# Altium schematic sheet 6.LC DSP_TMS320F28069.SchDoc: 6.6kW Daul OBC +11kW WPT
size A3; Revision: V 1.0; SheetNumber: 6; SheetTotal: 14; ImagePath: 0
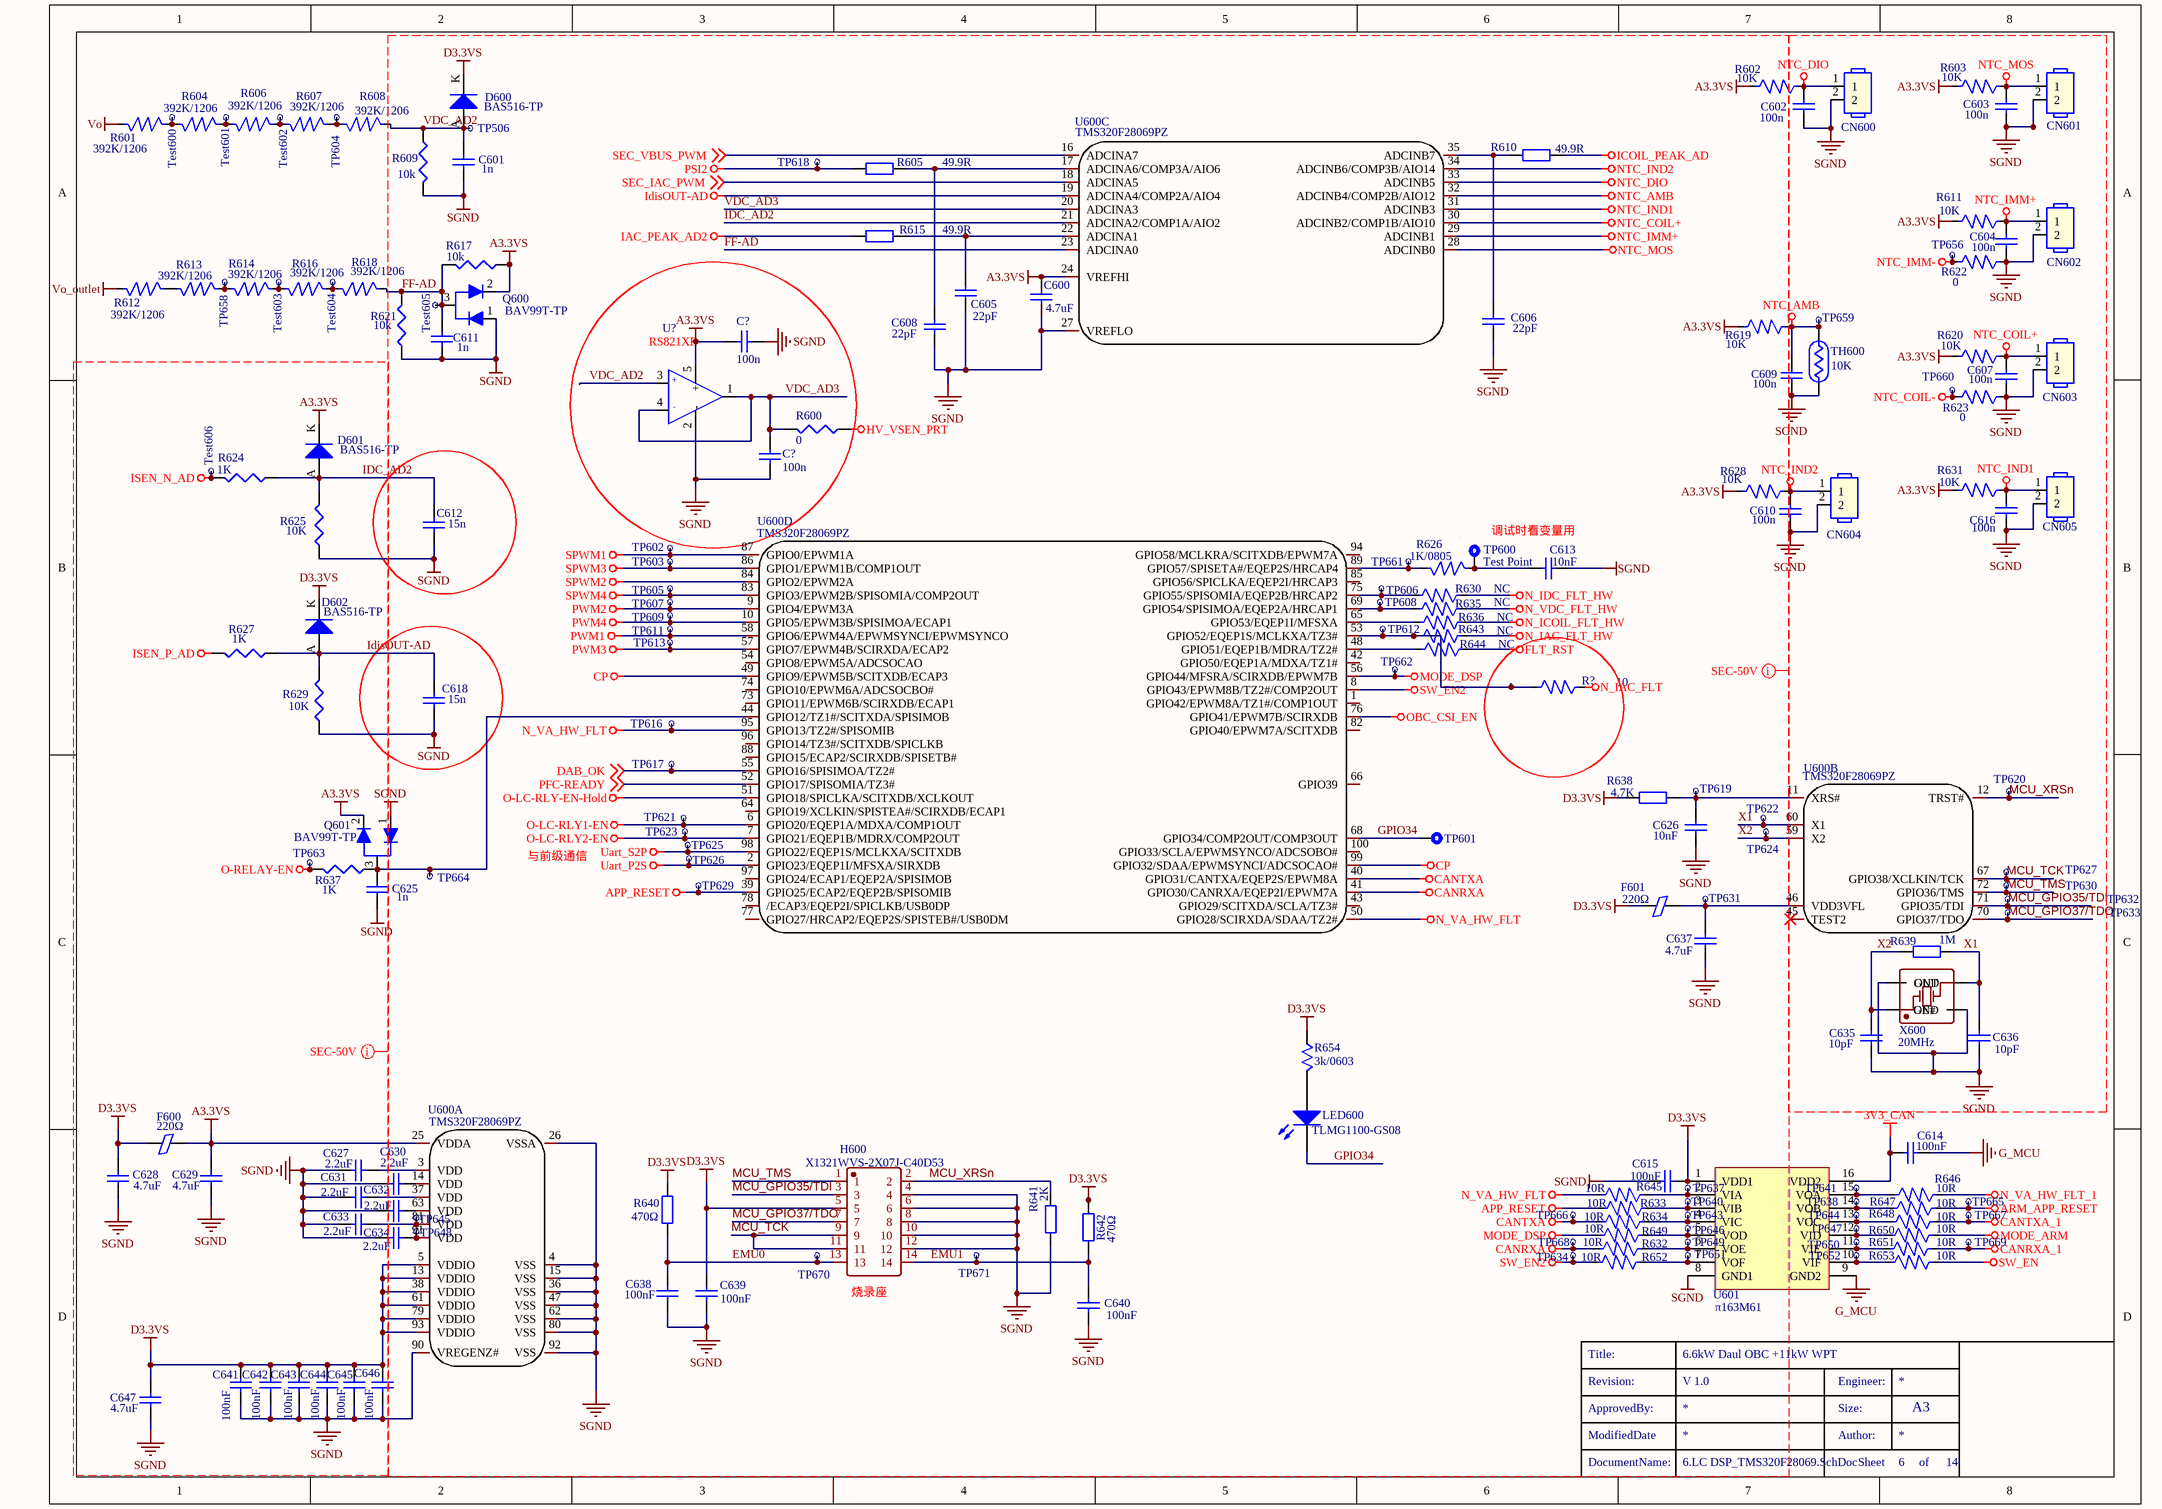
[diagram p0: 6.LC DSP_TMS320F28069.SchDoc]

## Parts
(Parts that share a designator on the sheet are numbered #1, #2 ... from top to bottom, then left to right.)
C600  4.7uF  [C0805]
C601  1n  [C0402]
C602  100n  [C0402]
C603  100n  [C0402]
C604  100n  [C0402]
C605  22pF  [C0402]
C606  22pF  [C0402]
C607  100n  [C0402]
C608  22pF  [C0402]
C609  100n  [C0402]
C610  100n  [C0402]
C611  1n  [C0402]
C612  value 15n  [C0402]  (hidden comment: 1n)
C613  10nF  [C0402]
C614  100nF  [C0402]
C615  100nF  [C0402]
C616  100n  [C0402]
C618  value 15n  [C0402]  (hidden comment: 1n)
C625  1n  [C0402]
C626  10nF  [C0603]
C627  2.2uF  [C0603]
C628  4.7uF  [C0805]
C629  4.7uF  [C0805]
C630  2.2uF  [C0603]
C631  2.2uF  [C0603]
C632  2.2uF  [C0603]
C633  2.2uF  [C0603]
C634  2.2uF  [C0603]
C635  10pF  [C0402]
C636  10pF  [C0402]
C637  4.7uF  [C0805]
C638  100nF  [C0603]
C639  100nF  [C0603]
C640  100nF  [C0603]
C641  100nF  [C0603]
C642  100nF  [C0603]
C643  100nF  [C0603]
C644  100nF  [C0603]
C645  100nF  [C0603]
C646  100nF  [C0603]
C647  4.7uF  [C0805]
C?#1  100n  [C0402]
C?#2  100n  [C0402]
CN600  (no value)  [HY_2MM_1*2P_90MOLEX01]
CN601  (no value)  [HY_2MM_1*2P_90MOLEX01]
CN602  (no value)  [HY_2MM_1*2P_90MOLEX01]
CN603  (no value)  [HY_2MM_1*2P_90MOLEX01]
CN604  (no value)  [HY_2MM_1*2P_90MOLEX01]
CN605  (no value)  [HY_2MM_1*2P_90MOLEX01]
D600  BAS516-TP  [D_SOD-523_SC-79]
D601  BAS516-TP  [D_SOD-523_SC-79]
D602  BAS516-TP  [D_SOD-523_SC-79]
F600  220Ω  [R0603]
F601  220Ω  [R0603]
H600  X1321WVS-2X07J-C40D53  [HDR-SMD_14P-P1.27-V-M-R2-C7-LS5.3]
LED600  TLMG1100-GS08  [LED_0603]
Q600  BAV99T-TP  [D_SOT-523]
Q601  BAV99T-TP  [D_SOT-523]
R600  0  [R0402]
R601  392K/1206  [R1206]
R602  10K  [R0402]
R603  10K  [R0402]
R604  392K/1206  [R1206]
R605  49.9R  [R0402]
R606  392K/1206  [R1206]
R607  392K/1206  [R1206]
R608  392K/1206  [R1206]
R609  10k  [R0402]
R610  49.9R  [R0402]
R611  10K  [R0402]
R612  392K/1206  [R1206]
R613  392K/1206  [R1206]
R614  392K/1206  [R1206]
R615  49.9R  [R0402]
R616  392K/1206  [R1206]
R617  10k  [R0402]
R618  392K/1206  [R1206]
R619  10K  [R0402]
R620  10K  [R0402]
R621  10k  [R0402]
R622  0  [R0402]
R623  0  [R0402]
R624  1K  [R0402]
R625  10K  [R0402]
R626  1K/0805  [R0805]
R627  1K  [R0402]
R628  10K  [R0402]
R629  10K  [R0402]
R630  NC  [R0402]
R631  10K  [R0402]
R632  10R  [R0402]
R633  10R  [R0402]
R634  10R  [R0402]
R635  NC  [R0402]
R636  NC  [R0402]
R637  1K  [R0402]
R638  4.7K  [R0603]
R639  1M  [R0402]
R640  470Ω  [R0402]
R641  2K  [R0402]
R642  470Ω  [R0402]
R643  NC  [R0402]
R644  NC  [R0402]
R645  10R  [R0402]
R646  10R  [R0402]
R647  10R  [R0402]
R648  10R  [R0402]
R649  10R  [R0402]
R650  10R  [R0402]
R651  10R  [R0402]
R652  10R  [R0402]
R653  10R  [R0402]
R654  3k/0603  [R0603]
R?  10  [R0402]
Test600  测试点  [测试点]  (value not drawn)
Test601  测试点  [测试点]  (value not drawn)
Test602  测试点  [测试点]  (value not drawn)
Test603  测试点  [测试点]  (value not drawn)
Test604  测试点  [测试点]  (value not drawn)
Test605  测试点  [测试点]  (value not drawn)
Test606  测试点  [测试点]  (value not drawn)
TH600  10K  [RT0603]
TP506  测试点  [测试点]  (value not drawn)
TP600  Test Point  [测试点]
TP601  Test Point  [测试点]  (value not drawn)
TP602  测试点  [测试点]  (value not drawn)
TP603  测试点  [测试点]  (value not drawn)
TP604  测试点  [测试点]  (value not drawn)
TP605  测试点  [测试点]  (value not drawn)
TP606  测试点  [测试点]  (value not drawn)
TP607  测试点  [测试点]  (value not drawn)
TP608  测试点  [测试点]  (value not drawn)
TP609  测试点  [测试点]  (value not drawn)
TP611  测试点  [测试点]  (value not drawn)
TP612  测试点  [测试点]  (value not drawn)
TP613  测试点  [测试点]  (value not drawn)
TP616  测试点  [测试点]  (value not drawn)
TP617  测试点  [测试点]  (value not drawn)
TP618  测试点  [测试点]  (value not drawn)
TP619  测试点  [测试点]  (value not drawn)
TP620  测试点  [测试点]  (value not drawn)
TP621  测试点  [测试点]  (value not drawn)
TP622  测试点  [测试点]  (value not drawn)
TP623  测试点  [测试点]  (value not drawn)
TP624  测试点  [测试点]  (value not drawn)
TP625  测试点  [测试点]  (value not drawn)
TP626  测试点  [测试点]  (value not drawn)
TP627  测试点  [测试点]  (value not drawn)
TP629  测试点  [测试点]  (value not drawn)
TP630  测试点  [测试点]  (value not drawn)
TP631  测试点  [测试点]  (value not drawn)
TP632  测试点  [测试点]  (value not drawn)
TP633  测试点  [测试点]  (value not drawn)
TP634  测试点  [测试点]  (value not drawn)
TP637  测试点  [测试点]  (value not drawn)
TP638  测试点  [测试点]  (value not drawn)
TP640  测试点  [测试点]  (value not drawn)
TP641  测试点  [测试点]  (value not drawn)
TP643  测试点  [测试点]  (value not drawn)
TP644  测试点  [测试点]  (value not drawn)
TP645  测试点  [测试点]  (value not drawn)
TP646  测试点  [测试点]  (value not drawn)
TP647  测试点  [测试点]  (value not drawn)
TP648  测试点  [测试点]  (value not drawn)
TP649  测试点  [测试点]  (value not drawn)
TP650  测试点  [测试点]  (value not drawn)
TP651  测试点  [测试点]  (value not drawn)
TP652  测试点  [测试点]  (value not drawn)
TP656  测试点  [测试点]  (value not drawn)
TP658  测试点  [测试点]  (value not drawn)
TP659  测试点  [测试点]  (value not drawn)
TP660  测试点  [测试点]  (value not drawn)
TP661  测试点  [测试点]  (value not drawn)
TP662  测试点  [测试点]  (value not drawn)
TP663  测试点  [测试点]  (value not drawn)
TP664  测试点  [测试点]  (value not drawn)
TP665  测试点  [测试点]  (value not drawn)
TP666  测试点  [测试点]  (value not drawn)
TP667  测试点  [测试点]  (value not drawn)
TP668  测试点  [测试点]  (value not drawn)
TP669  测试点  [测试点]  (value not drawn)
TP670  测试点  [测试点]  (value not drawn)
TP671  测试点  [测试点]  (value not drawn)
U600  TMS320F28069PZ  [TQFP_100_14X14X05P_EP]  (parts A,B,C,D of 4)
U601  π163M61  [SOIC_W_16]
U?  RS821XF  [SOT23-5]
X600  20MHz  [CRYSTAL-SMD_4P-L3.2-W2.5-BL]

## Nets
3V3_CAN: C614.2 U601.16(VDD2)
A3.3VS: C600.1 C629.1 C?#1.2 D601.K F600.2 Q600.2(K) Q601.2(K) R602.2 R603.2 R611.2 R617.1 R619.2 R620.2 R628.2 R631.2 U600.24(VREFHI) U600.25(VDDA) U?.5(+)
APP_RESET: R633.2 TP629.1 U600.39(GPIO25/ECAP2/EQEP2B/SPISOMIB)
ARM_APP_RESET: R647.1 TP665.1
CANRXA: R632.1 TP668.1 U600.41(GPIO30/CANRXA/EQEP2I/EPWM7A)
CANRXA_1: R651.2 TP669.1
CANTXA: R634.2 TP666.1 U600.40(GPIO31/CANTXA/EQEP2S/EPWM8A)
CANTXA_1: R648.1 TP667.1
CP: U600.49(GPIO9/EPWM5B/SCITXDB/ECAP3) U600.99(GPIO32/SDAA/EPWMSYNCI/ADCSOCAO#)
D3.3VS: C615.1 C628.1 C639.1 C641.1 C642.1 C643.1 C644.1 C645.1 C646.1 C647.1 D600.K D602.K F600.1 F601.1 H600.5 R638.1 R640.2 R642.2 R654.2 U600.5(VDDIO) U600.13(VDDIO) U600.38(VDDIO) U600.61(VDDIO) U600.79(VDDIO) U600.93(VDDIO) U601.1(VDD1)
FLT_RST: R644.1
G_MCU: C614.1 U601.9(GND2)
HV_VSEN_PRT: R600.1
IAC_PEAK_AD2: R615.1
ICOIL_PEAK_AD: R610.2
IdisOUT-AD: C618.1 D602.A R627.1 R629.2 U600.19(ADCINA4/COMP2A/AIO4)
ISEN_N_AD: R624.2 Test606.1
ISEN_P_AD: R627.2
MODE_ARM: R650.2
MODE_DSP: R649.2 TP662.1 U600.56(GPIO44/MFSRA/SCIRXDB/EPWM7B)
N_IAC_FLT: R?.1
N_IAC_FLT_HW: R643.1
N_ICOIL_FLT_HW: R636.1
N_IDC_FLT_HW: R630.1
N_VA_HW_FLT: R645.2 TP616.1 U600.50(GPIO28/SCIRXDA/SDAA/TZ2#) U600.95(GPIO13/TZ2#/SPISOMIB)
N_VA_HW_FLT_1: R646.1
N_VDC_FLT_HW: R635.1
NTC_AMB: C609.2 R619.1 TH600.2 TP659.1 U600.32(ADCINB4/COMP2B/AIO12)
NTC_COIL+: C607.2 CN603.1 R620.1 U600.30(ADCINB2/COMP1B/AIO10)
NTC_COIL-: R623.2 TP660.1
NTC_DIO: C602.2 CN600.1 R602.1 U600.33(ADCINB5)
NTC_IMM+: C604.2 CN602.1 R611.1 U600.29(ADCINB1)
NTC_IMM-: R622.2 TP656.1
NTC_IND1: C616.2 CN605.1 R631.1 U600.31(ADCINB3)
NTC_IND2: C610.2 CN604.1 R628.1 U600.34(ADCINB6/COMP3B/AIO14)
NTC_MOS: C603.2 CN601.1 R603.1 U600.28(ADCINB0)
O-LC-RLY1-EN: TP621.1 U600.6(GPIO20/EQEP1A/MDXA/COMP1OUT)
O-LC-RLY2-EN: TP623.1 U600.7(GPIO21/EQEP1B/MDRX/COMP2OUT)
O-LC-RLY-EN-Hold: U600.51(GPIO18/SPICLKA/SCITXDB/XCLKOUT)
O-RELAY-EN: R637.2 TP663.1
OBC_CSI_EN: U600.76(GPIO41/EPWM7B/SCIRXDB)
PSI2: R605.1 TP618.1
PWM1: TP611.1 U600.58(GPIO6/EPWM4A/EPWMSYNCI/EPWMSYNCO)
PWM2: TP607.1 U600.9(GPIO4/EPWM3A)
PWM3: TP613.1 U600.57(GPIO7/EPWM4B/SCIRXDA/ECAP2)
PWM4: TP609.1 U600.10(GPIO5/EPWM3B/SPISIMOA/ECAP1)
SGND: C600.2 C601.1 C602.1 C603.1 C604.1 C605.2 C606.2 C607.1 C608.2 C609.1 C610.1 C611.1 C612.2 C613.2 C615.2 C616.1 C618.2 C625.1 C626.2 C627.2 C628.2 C629.2 C630.2 C631.2 C632.2 C633.2 C634.2 C635.2 C636.2 C637.2 C638.2 C639.2 C640.2 C641.2 C642.2 C643.2 C644.2 C645.2 C646.2 C647.2 C?#1.1 C?#2.1 CN600.2 CN601.2 CN602.2 CN603.2 CN604.2 CN605.2 H600.4 H600.6 H600.8 H600.10 H600.12 Q600.1(A) Q601.1(A) R609.2 R621.1 R622.1 R623.1 R625.1 R629.1 R641.1 TH600.1 U600.4(VSS) U600.15(VSS) U600.26(VSSA) U600.27(VREFLO) U600.36(VSS) U600.47(VSS) U600.62(VSS) U600.80(VSS) U600.90(VREGENZ#) U600.92(VSS) U601.8(GND1) U?.2(-) X600.2(GND) X600.4(GND)
SPWM1: TP602.1 U600.87(GPIO0/EPWM1A)
SPWM2: U600.84(GPIO2/EPWM2A)
SPWM3: TP603.1 U600.86(GPIO1/EPWM1B/COMP1OUT)
SPWM4: TP605.1 U600.83(GPIO3/EPWM2B/SPISOMIA/COMP2OUT)
SW_EN: R653.2
SW_EN2: R652.1 TP634.1 U600.8(GPIO43/EPWM8B/TZ2#/COMP2OUT)
Uart_P2S: TP626.1 U600.2(GPIO23/EQEP1I/MFSXA/SIRXDB)
Uart_S2P: TP625.1 U600.98(GPIO22/EQEP1S/MCLKXA/SCITXDB)
Vo: R601.2
Vo_outlet: R612.2
DAB_OK: TP617.1 U600.55(GPIO16/SPISIMOA/TZ2#) ; off-sheet DAB_OK
EMU0: C638.1 H600.13 R640.1 TP670.1
EMU1: C640.1 H600.14 R642.1 TP671.1
FF-AD: C611.2 Q600.3(COMMMON) R617.2 R618.1 R621.2 Test605.1 U600.23(ADCINA0)
GPIO34: LED600.2(K) TP601.1 U600.68(GPIO34/COMP2OUT/COMP3OUT)
IDC_AD2: C612.1 D601.A R624.1 R625.2 U600.21(ADCINA2/COMP1A/AIO2)
MCU_GPIO35/TDI: H600.3 TP632.1 U600.71(GPIO35/TDI)
MCU_GPIO37/TDO: H600.7 TP633.1 U600.70(GPIO37/TDO)
MCU_TCK: H600.9 H600.11 TP627.1 U600.67(GPIO38/XCLKIN/TCK)
MCU_TMS: H600.1 TP630.1 U600.72(GPIO36/TMS)
MCU_XRSn: H600.2 R641.2 TP620.1 U600.12(TRST#)
PFC-READY: U600.52(GPIO17/SPISOMIA/TZ3#) ; off-sheet PFC-READY
SEC_IAC_PWM: U600.18(ADCINA5) ; off-sheet SEC_IAC_PWM
SEC_VBUS_PWM: U600.16(ADCINA7) ; off-sheet SEC_VBUS_PWM
VDC_AD2: C601.2 D600.A R608.1 R609.1 TP506.1 U?.3(+VIN)
VDC_AD3: C?#2.2 R600.2 U600.20(ADCINA3) U?.1(OUTPUT) U?.4(-VIN)
X1: C636.1 R639.2 TP622.1 U600.60(X1) X600.3(OUT)
X2: C635.1 R639.1 TP624.1 U600.59(X2) X600.1(OE#)
NetC605_1: C605.1 R615.2 U600.22(ADCINA1)
NetC606_1: C606.1 R610.1 U600.35(ADCINB7)
NetC608_1: C608.1 R605.2 U600.17(ADCINA6/COMP3A/AIO6)
NetC613_1: C613.1 R626.2 TP600.1
NetC625_2: C625.2 Q601.3(COMMMON) R637.1 TP664.1 U600.44(GPIO12/TZ1#/SCITXDA/SPISIMOB)
NetC626_1: C626.1 R638.2 TP619.1 U600.11(XRS#)
NetC627_1: C627.1 U600.3(VDD)
NetC630_1: C630.1 U600.14(VDD)
NetC631_1: C631.1 U600.37(VDD)
NetC632_1: C632.1 U600.63(VDD)
NetC633_1: C633.1 TP645.1 U600.81(VDD)
NetC634_1: C634.1 TP648.1 U600.91(VDD)
NetC637_1: C637.1 F601.2 TP631.1 U600.46(VDD3VFL)
NetLED600_1: LED600.1(A) R654.1
NetR601_1: R601.1 R604.2 Test600.1
NetR604_1: R604.1 R606.2 Test601.1
NetR606_1: R606.1 R607.2 Test602.1
NetR607_1: R607.1 R608.2 TP604.1
NetR612_1: R612.1 R613.2
NetR613_1: R613.1 R614.2 TP658.1
NetR614_1: R614.1 R616.2 Test603.1
NetR616_1: R616.1 R618.2 Test604.1
NetR626_1: R626.1 TP661.1 U600.89(GPIO57/SPISETA#/EQEP2S/HRCAP4)
NetR630_2: R630.2 TP606.1 U600.75(GPIO55/SPISOMIA/EQEP2B/HRCAP2)
NetR632_2: R632.2 TP649.1 U601.6(VOE)
NetR633_1: R633.1 TP640.1 U601.3(VIB)
NetR634_1: R634.1 TP643.1 U601.4(VIC)
NetR635_2: R635.2 TP608.1 U600.69(GPIO54/SPISIMOA/EQEP2A/HRCAP1)
NetR636_2: R636.2 U600.65(GPIO53/EQEP1I/MFSXA)
NetR643_2: R643.2 R?.2 TP612.1 U600.53(GPIO52/EQEP1S/MCLKXA/TZ3#)
NetR644_2: R644.2 U600.48(GPIO51/EQEP1B/MDRA/TZ2#)
NetR645_1: R645.1 TP637.1 U601.2(VIA)
NetR646_2: R646.2 TP638.1 U601.15(VOA)
NetR647_2: R647.2 TP641.1 U601.14(VOB)
NetR648_2: R648.2 TP644.1 U601.13(VOC)
NetR649_1: R649.1 TP646.1 U601.5(VOD)
NetR650_1: R650.1 TP647.1 U601.12(VID)
NetR651_1: R651.1 TP650.1 U601.11(VIE)
NetR652_2: R652.2 TP651.1 U601.7(VOF)
NetR653_1: R653.1 TP652.1 U601.10(VIF)

Not connected (* = marked no-connect by the designer): U600 1(GPIO42/EPWM8A/TZ1#/COMP1OUT) 42(GPIO50/EQEP1A/MDXA/TZ1#) 43(GPIO29/SCITXDA/SCLA/TZ3#) 45(TEST2)* 54(GPIO8/EPWM5A/ADCSOCAO) 64(GPIO19/XCLKIN/SPISTEA#/SCIRXDB/ECAP1) 66(GPIO39) 73(GPIO11/EPWM6B/SCIRXDB/ECAP1) 74(GPIO10/EPWM6A/ADCSOCBO#) 77(GPIO27/HRCAP2/EQEP2S/SPISTEB#/USB0DM) 78(/ECAP3/EQEP2I/SPICLKB/USB0DP) 82(GPIO40/EPWM7A/SCITXDB) 85(GPIO56/SPICLKA/EQEP2I/HRCAP3) 88(GPIO15/ECAP2/SCIRXDB/SPISETB#) 94(GPIO58/MCLKRA/SCITXDB/EPWM7A) 96(GPIO14/TZ3#/SCITXDB/SPICLKB) 97(GPIO24/ECAP1/EQEP2A/SPISIMOB) 100(GPIO33/SCLA/EPWMSYNCO/ADCSOBO#)

## Layout directives
net class SEC-50V: A3.3VS, APP_RESET, CANRXA, CANTXA, CP, D3.3VS, DAB_OK, EMU0, EMU1, FF-AD, FLT_RST, GPIO34, HV_VSEN_PRT, IAC_PEAK_AD2, ICOIL_PEAK_AD, IDC_AD2, IdisOUT-AD, MCU_GPIO35/TDI, MCU_GPIO37/TDO, MCU_TCK, MCU_TMS, MCU_XRSn, MODE_DSP, N_IAC_FLT, N_IAC_FLT_HW, N_ICOIL_FLT_HW, N_IDC_FLT_HW, N_VA_HW_FLT, N_VDC_FLT_HW, NTC_AMB, NTC_COIL+, NTC_DIO, NTC_IMM+, NTC_IND1, NTC_IND2, NTC_MOS, O-LC-RLY1-EN, O-LC-RLY2-EN, O-LC-RLY-EN-Hold, OBC_CSI_EN, PFC-READY, PSI2, PWM1, PWM2, PWM3, PWM4, SEC_IAC_PWM, SEC_VBUS_PWM, SGND, SPWM1, SPWM2, SPWM3, SPWM4, SW_EN2, Uart_P2S, Uart_S2P, VDC_AD2, VDC_AD3, X1, X2

## Notes on the sheet
- 调试时看变量用
- 与前级通信
- (near H600) 烧录座
- Revision:
- Title:
- Engineer:
- ModifiedDate
- ApprovedBy:
- Author:
- Size:
- A3
- DocumentName:
- Sheet
- of

## Library data of the parts
C600 C628 C629 C637 C647 = 4.7uF 16V ±10%  X7R  0805-1: 温度范围: -55℃~﹢125℃; 料号: 90-E00C0067; 品名: CAP CER 4.7uF 16V ±10%  X7R AEC-Q200 0805,Murata#GCM21BR71C475KA73L; 厂商: Murata; 规格: GCM21BR71C475KA73L(Murata); 耐压值: 16V; Qualified: AEC-Q200
C601-C604 C607 C609-C612 C616 C618 C625 C?#1 C?#2 = Cap: Capacitor; Published: 8-Jun-2000; LatestRevisionDate: 17-Jul-2002; LatestRevisionNote: Re-released for DXP Platform.; PackageReference: RAD-0.3; Publisher: Altium Limited; PackageDescription: Radial Cap, Thru-Hole; 2 Leads; 0.3 in Pin Spacing
  C601 C611 C625: VALUE: 1n
  C602-C604 C607 C609 C610 C616 C?#1 C?#2: VALUE: 100n
C605 C606 = 10nF 50V ±10% X7R 0402: 温度范围: -55℃~﹢125℃; 料号: 90-E00C0086; 品名: CAP CER 10nF 50V ±10% X7R 0402,TAIYO YUDEN#UMK105B7103KVHF; 厂商: TAIYO YUDEN; 规格: UMK105B7103KVHF(TAIYO YUDEN); 耐压值: 50V; Qualified: AEC-Q200
C608 = 100pF 50V ±5% NPO 0402: 温度范围: -55℃~﹢125℃; 料号: 90-E00C0021; 品名: CAP CER 100pF 50V ±5% NPO 0402, TAIYO YUDEN#UMK105CG101JVHF; 厂商: TAIYO YUDEN; 规格: UMK105CG101JVHF(TAIYO YUDEN); 耐压值: 50V; Qualified: AEC-Q200
C613 = Cap: Manufacturer: Yageo; Manufacturer P/N: AC0402KRX7R9BB103; DIP/SMD: SMD
C614 C615 = Cap: Manufacturer: Yageo; Manufacturer P/N: AC0402KRX7R9BB104; DIP/SMD: SMD
C626 = 10nF 50V ±10% X7R 0603: 温度范围: -55℃~﹢125℃; 料号: 90-E00C0056; 品名: CAP CER 10nF 50V ±10% X7R 0603,TAIYO YUDEN#UMK107B7103KAHT; 厂商: TAIYO YUDEN; 规格: UMK107B7103KAHT(TAIYO YUDEN); 耐压值: 50V; Qualified: AEC-Q200
C627 C630-C634 = 2.2uF 6.3V ±10% X7R 0603: 温度范围: -55℃~﹢125℃; 料号: 90-E00C0031; 品名: CAP CER 2.2uF 6.3V ±10% X7R 0603, TAIYO YUDEN#JMK107B7225KAHTR; 厂商: TAIYO YUDEN; 规格: JMK107B7225KAHTR(TAIYO YUDEN); 耐压值: 6.3V; Qualified: AEC-Q200
C635 C636 = 8pF 50V±0.5 C0G  0402: 温度范围: -55℃~﹢125℃; 料号: 13100-S002091H-00; 品名: CAP CER 8pF 50V ±0.5pF C0G 0402, Murata#GCM1555C1H8R0DA16D; 厂商: MURATA; 规格: GCM1555C1H8R0DA16D(MURATA); 耐压值: 50V; Qualified: AEC-Q200
C638-C646 = 100nF 50V ±10% X7R 0603-1: 温度范围: -55℃~﹢125℃; 料号: 90-E00C0045; 品名: CAP CER 100nF 50V ±10% X7R 0603, TDK#C1608X7R1H104K; 厂商: TDK; 规格: C1608X7R1H104K(TDK); 耐压值: 50V; Qualified: AEC-Q200
CN600-CN605 = CN1.25-02P
D600-D602 = DIODE_MICRO: DIODE RECTIFIER; VALUE: BAS516-TP
F600 F601 = Ferrite Bead 220±25％Ω@100MHz 2.2A 0.05Ω F0603_0.95 BLM18KG221SH1D(Murata): 厂商: MURATA; 品名: Ferrite Bead 220±25％Ω@100MHz 2.2A 0.05Ω F0603_0.95, Murata#BLM18KG221SH1D; 料号: 90-E03L0006; Qualified: AEC-Q200; 温度范围: -55℃~﹢125℃; 规格: BLM18KG221SH1D(Murata); BCS料号: *; 耐压值: *
H600 = X1321WVS-2X07J-C40D53: BOM_Manufacturer: XKB Connectivity(中国星坤); Contributor: LCSC; BOM_Supplier: LCSC; BOM_Supplier Part: C2881912; BOM_Manufacturer Part: X1321WVS-2x07J-C40D53; link: https://atta.szlcsc.com/upload/public/pdf/source/20211011/053ED0B5930C4705FD984F451B971973.pdf; BOM_JLCPCB Part Class: Extended Part; spicePre: H; spiceSymbolName: X1321WVS-2X07J-C40D53
LED600 = LED1
Q600 Q601 = DIODE_BAV99: BAV99 DUAL IN DIODE; VALUE: BAV99T-TP
R600 R609 R617 R621 R624 R625 R627 R629 R637 = Res3: Resistor; Published: 8-Jun-2000; LatestRevisionDate: 29-May-2009; LatestRevisionNote: IPC-7351 Footprint Added.; PackageReference: J1-0603; Publisher: Altium Limited; PackageDescription: Chip Resistor
  R600: VALUE: 0
  R609 R617 R621: VALUE: 10k
  R624 R627 R637: VALUE: 1K
  R625 R629: VALUE: 10K
R601 R604 R606-R608 R612-R614 R616 R618 = RESISTOR: 0805W8F3923T5E; value: 392K/1206
R602 R603 R611 R619 R620 R622 R623 R628 R631 = RESISTOR_0805: RESISTOR
  R602 R603 R611 R619 R620 R628 R631: VALUE: 10K
  R622 R623: VALUE: 0
R605 R610 R615 = 100R ±1%  1/16W 0402: 料号: 90-E00R0040; 规格: RMC1/16SK101FTH(KAMAYA); 品名: RES SMD 100Ω ±1% 1/16W 0402, KAMAYA#RMC1/16SK101FTH; 温度范围: -55℃~+155℃; 厂商: KAMAYA; Qualified: AEC-Q200; 耐压值: 50V
R626 = RESISTOR_0805: Manufacturer: Yageo; Manufacturer P/N: AC0805FR-071KL; DIP/SMD: SMD
R630 R633-R636 R643-R649 R? = RESISTOR_0805: Manufacturer: Yageo; Manufacturer P/N: AC0402FR-07330RL; DIP/SMD: SMD
R632 R650-R653 = RESISTOR_0805: Manufacturer: Yageo; Manufacturer P/N: AC0402FR-07680RL; DIP/SMD: SMD
R638 = 4.7K ±1%  1/10W 0603: 料号: 90-E00R0044; 规格: RMC1/16K472FTP(KAMAYA); 品名: RES,SMD 4.7KΩ ±1%, 1/10W,0603,KAMAYA#RMC1/16K472FTP; 厂商: KAMAYA; Qualified: AEC-Q200; 耐压值: 50V; 温度范围: -55℃~+155℃
R639 = 1M ±5% 1/16W 0402: 料号: 13000-S170014H-00; 规格: RMC1/16S-105JTH(KAMAYA); 品名: RES SMD 1M ±5% 1/16W 0402, KAMAYA#RMC1/16S-105JTH; 温度范围: -55℃~+155℃; 厂商: KAMAYA; Qualified: AEC-Q200; 耐压值: 50V
R640 R642 = 470Ω ±1% 1/16W 0402: 料号: 90-E00R0239; 规格: RMC1/16SK471FTH(KAMAYA); 品名: RES SMD 470Ω ±1% 1/16W 0402, KAMAYA#RMC1/16SK471FTH; 温度范围: -55℃~+155℃; 厂商: KAMAYA; Qualified: AEC-Q200; 耐压值: 50V
R641 = 2K ±1%  1/16W 0402: 料号: 13000-S170047H-00; 规格: RMC1/16SK202FTH(KAMAYA); 品名: RES SMD 2KΩ ±1% 1/16W 0402, KAMAYA#RMC1/16SK202FTH; 温度范围: -55℃~+155℃; 厂商: KAMAYA; Qualified: AEC-Q200; 耐压值: 50V
R654 = RES_GENERAL
TH600 = NTC: NTC RESISTOR; Parameter: NTC; VALUE: 10K
TP600 TP601 = Test Point: Test Point 1mm
U600 = TMS320F28069PZT: Manufacturer: TI; Convert to PCB: yes; Origin Footprint: LQFP-100_L14.0-W14.0-P0.50-LS16.0-BL; Name: TMS320F28069PZ; Symbol: TMS320F28069PZ; Device: TMS320F28069PZT; Supplier: LCSC; Manufacturer Part: TMS320F28069PZT; Supplier Part: C82775; JLCPCB Part Class: Extended Part; Add into BOM: yes
U601 = 163M61
U? = OPA365: VALUE: RS821XF
X600 = 20MHz: BOM_Manufacturer: TAE(雅晶鑫); BOM_Manufacturer Part: TAXM20M4RLBCCT2T; nameAlias: Frequency; Contributor: LCSC; BOM_Supplier: LCSC; BOM_Supplier Part: C172730; BOM_JLCPCB Part Class: Extended Part; spicePre: X; spiceSymbolName: SMD-3225_4P20MHZ20PF10PPM